# EAGLE schematic motorShield (EAGLE 7.4.0)
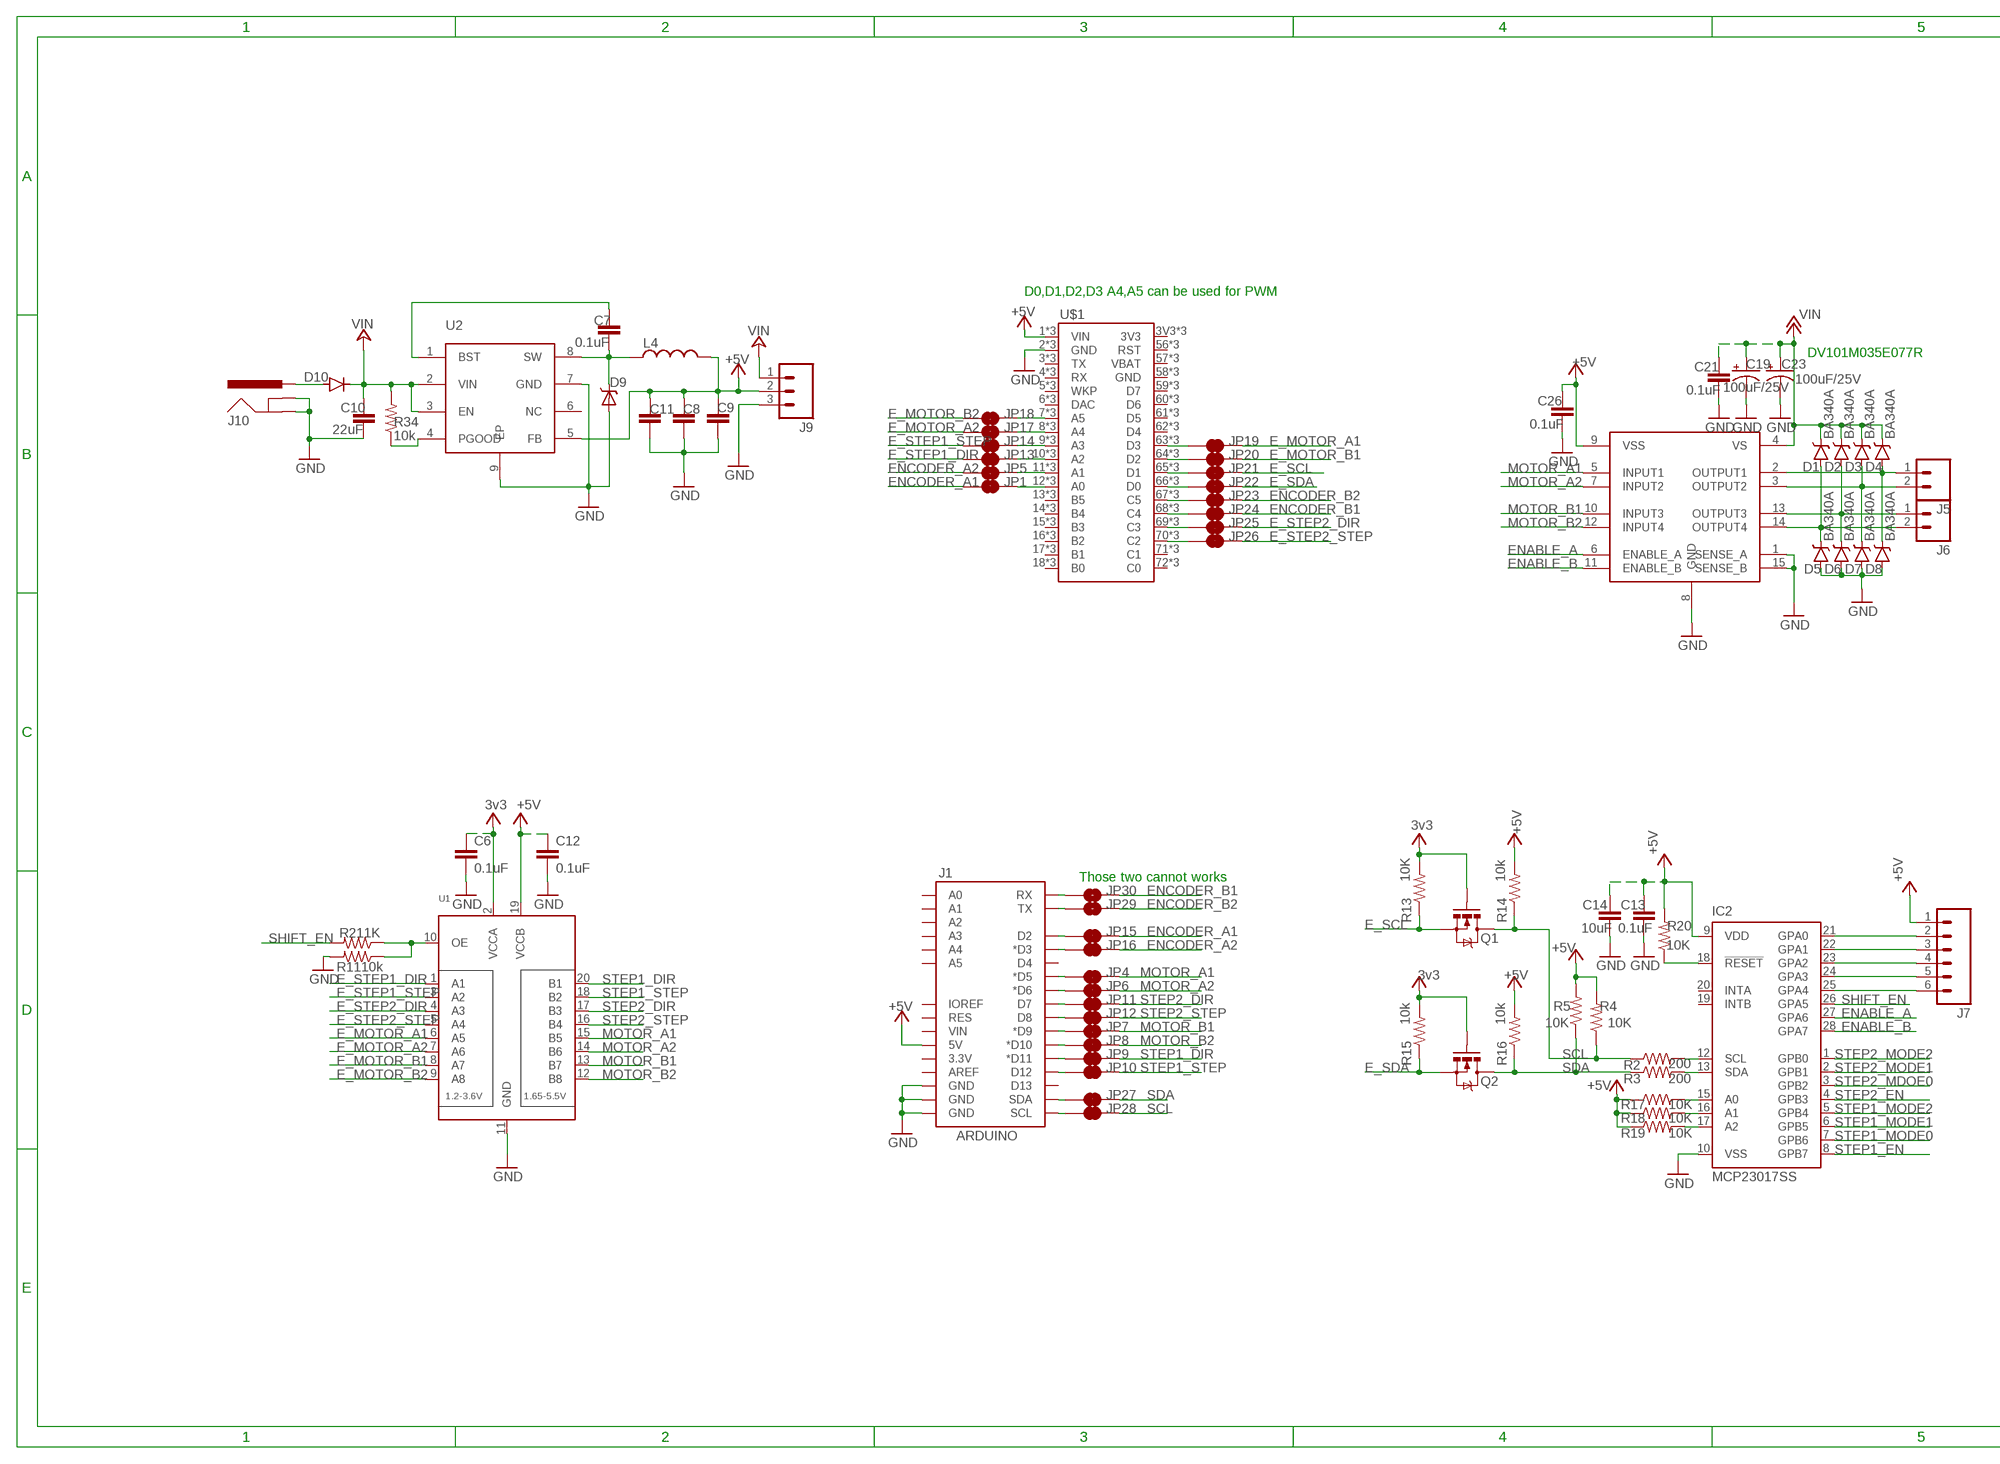
[diagram p0: schematic, sheet 1, part 1 of 2]
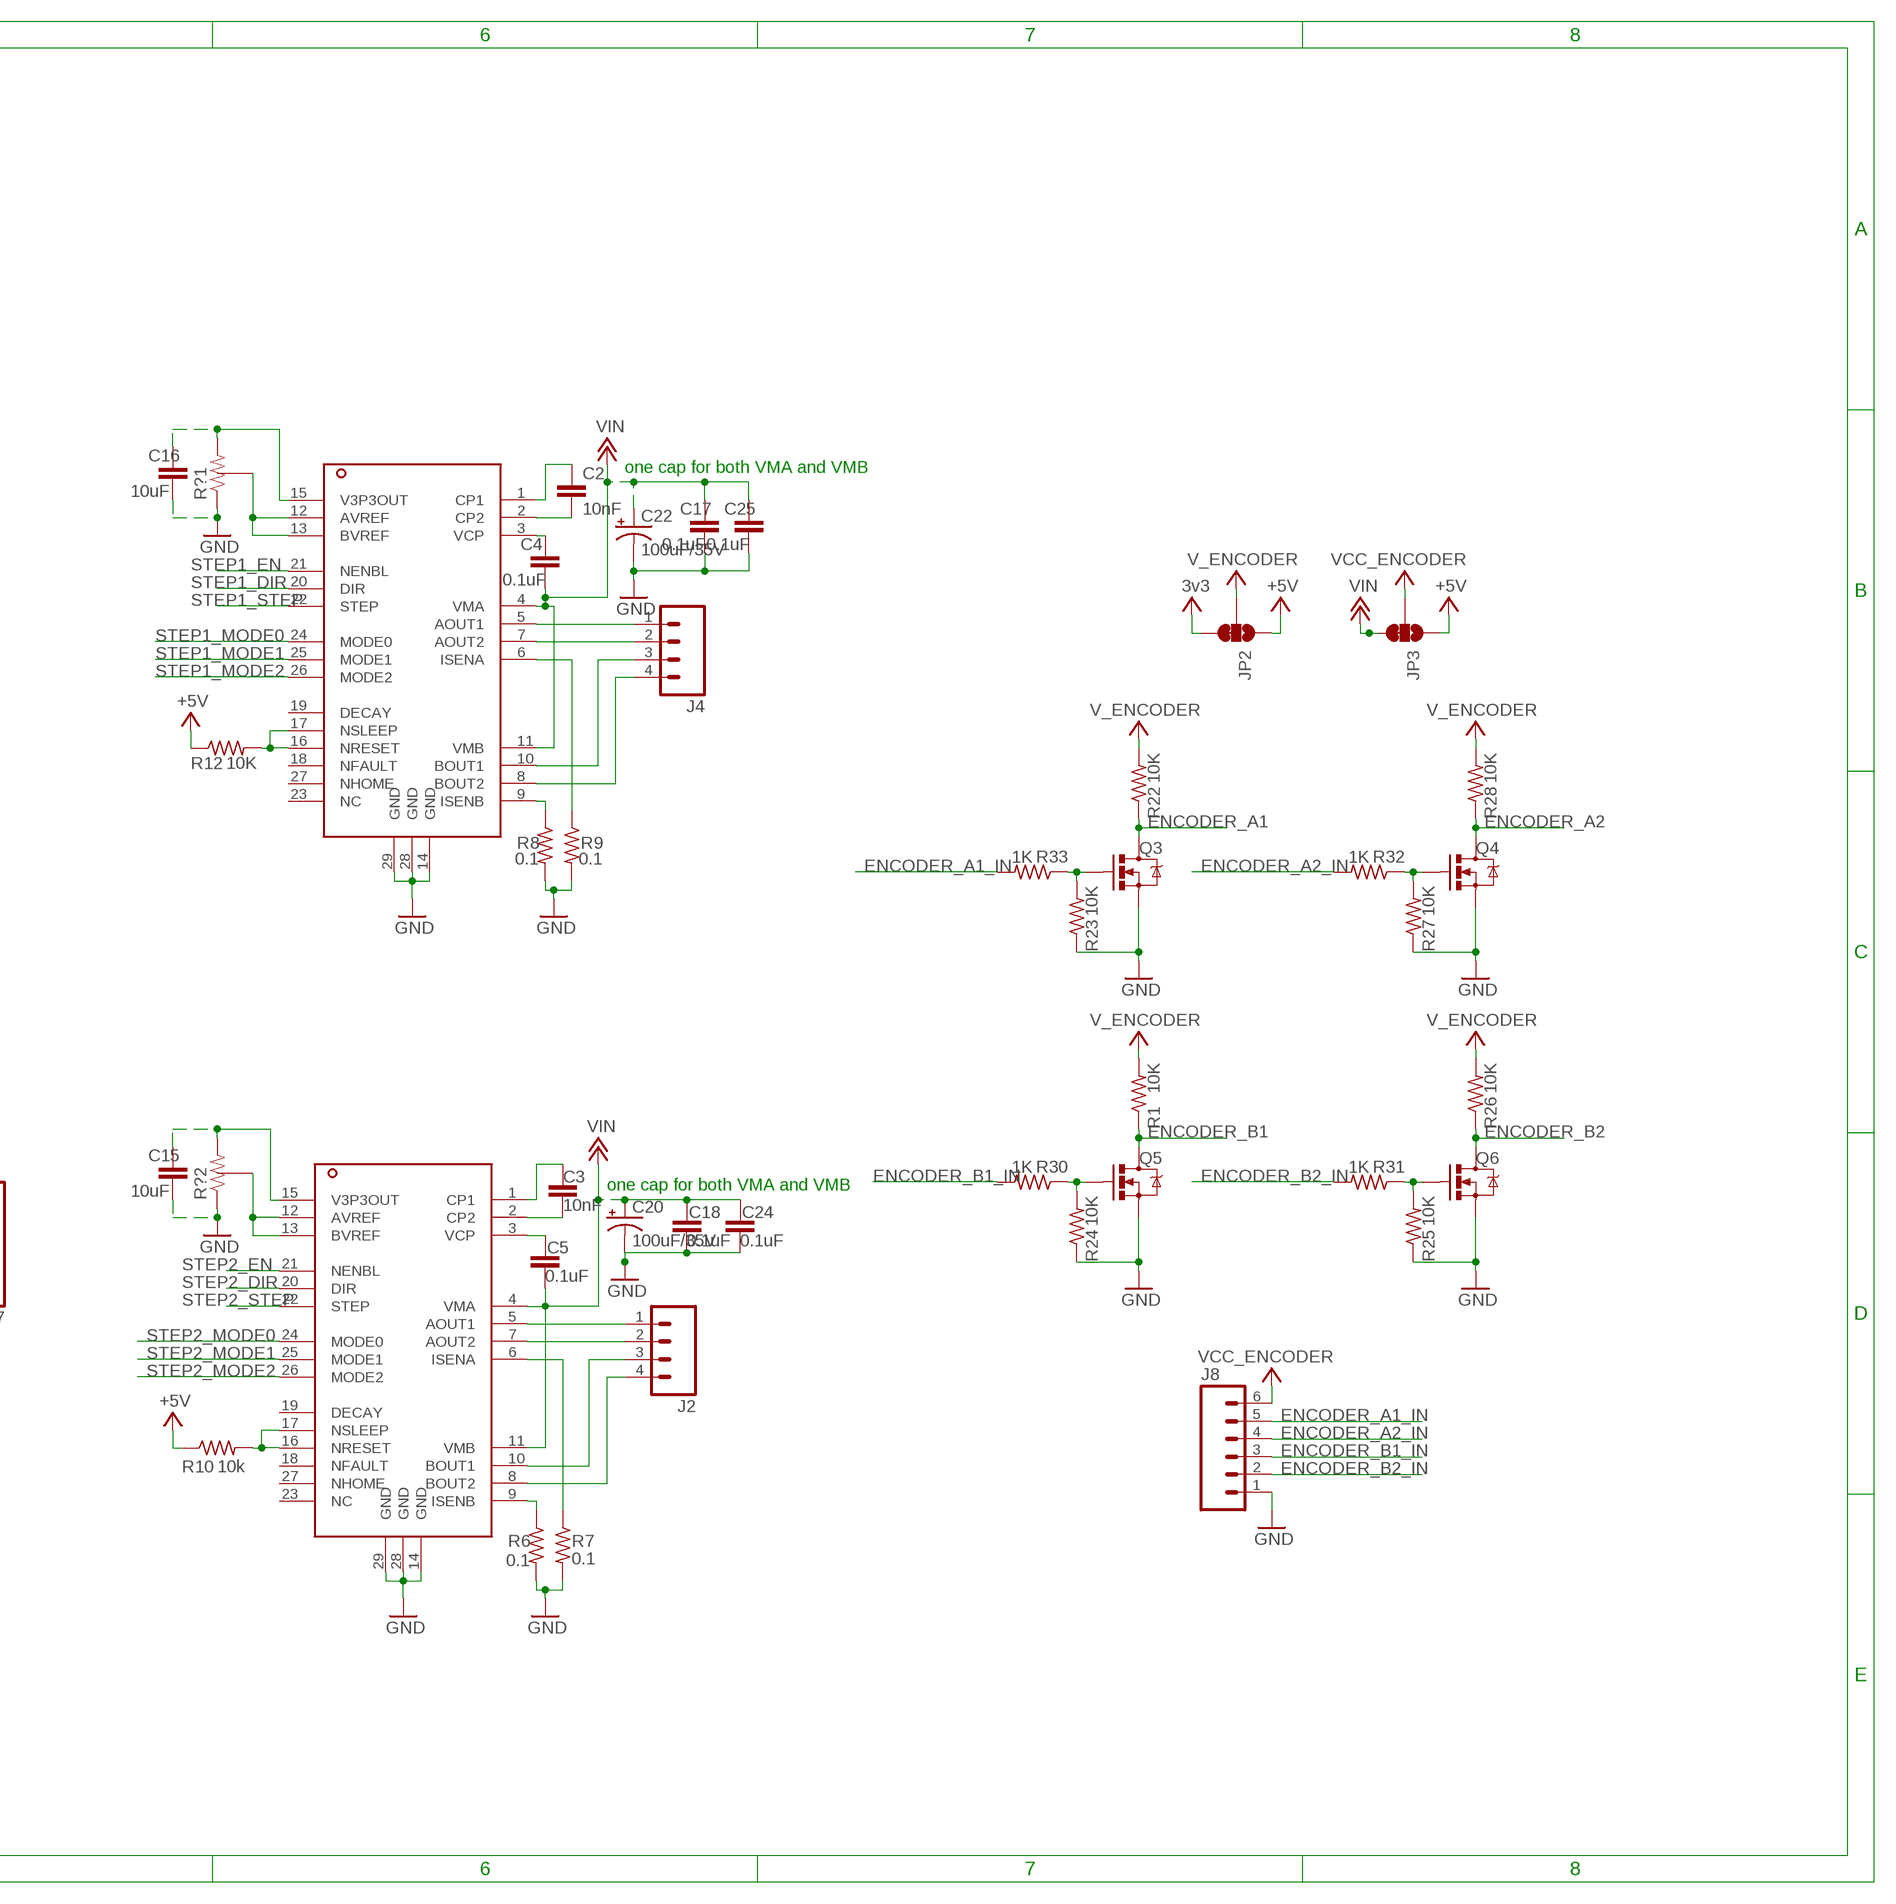
[diagram p1: schematic, sheet 1, part 2 of 2]

## Parts
C2  10nF  CAP_NONE_POL  [0603]
C3  10nF  CAP_NONE_POL  [0603]
C4  0.1uF  CAP_NONE_POL  [0603]
C5  0.1uF  CAP_NONE_POL  [0603]
C6  0.1uF  CAP_NONE_POL  [0603]
C7  0.1uF  0.1UF-100V-10%(0603)  [0603-CAP]
C8  10UF10V10%(0805)  [0805-CAP]
C9  10UF10V10%(0805)  [0805-CAP]
C10  22uF  22UF-16V-20%-(1210)  [1210]
C11  10UF10V10%(0805)  [0805-CAP]
C12  0.1uF  CAP_NONE_POL  [0603]
C13  0.1uF  CAP_NONE_POL  [0603]
C14  10uF  CAP_NONE_POL  [0603]
C15  10uF  CAP_NONE_POL  [0603]
C16  10uF  CAP_NONE_POL  [0603]
C17  0.1uF  CAP_NONE_POL  [0603]
C18  0.1uF  CAP_NONE_POL  [0603]
C19  100uF/25V  CAP_POLD  [PANASONIC_D]
C20  100uF/35V  CAP_POLD  [PANASONIC_D]
C21  0.1uF  CAP_NONE_POL  [0603]
C22  100uF/35V  CAP_POLD  [PANASONIC_D]
C23  100uF/25V  CAP_POLD  [PANASONIC_D]
C24  0.1uF  CAP_NONE_POL  [0603]
C25  0.1uF  CAP_NONE_POL  [0603]
C26  0.1uF  CAP_NONE_POL  [0603]
D1  BA340A  B340A  [SMA-DIODE]
D2  BA340A  B340A  [SMA-DIODE]
D3  BA340A  B340A  [SMA-DIODE]
D4  BA340A  B340A  [SMA-DIODE]
D5  BA340A  B340A  [SMA-DIODE]
D6  BA340A  B340A  [SMA-DIODE]
D7  BA340A  B340A  [SMA-DIODE]
D8  BA340A  B340A  [SMA-DIODE]
D9  DIODE_SCHOTTKYA  [DIODE_SMA]
D10  DIODEB  [DIODE-DO-220AA_NT(SMP)]
IC2  MCP23017SS  [SSOP28]
J1  ARDUINO  ARDUINO_R3_SHIELDUNO_R3_SHIELD_LOCK  [UNO_R3_SHIELD_LOCK]
J2  M04SCREW  [SCREWTERMINAL-3.5MM-4]
J4  M04SCREW  [SCREWTERMINAL-3.5MM-4]
J5  M023.5MM_LOCK  [SCREWTERMINAL-3.5MM-2_LOCK]
J6  M023.5MM_LOCK  [SCREWTERMINAL-3.5MM-2_LOCK]
J7  M06POLAR  [MOLEX-1X6]
J8  M06POLAR  [MOLEX-1X6]
J9  M03SCREW  [SCREWTERMINAL-3.5MM-3]
J10  POWER_JACKPTH  [POWER_JACK_PTH]
JP1  JUMPER-PAD-2-NC_BY_TRACENO_SILK  [PAD-JUMPER-2-NC_BY_TRACE_NO_SILK]
JP2  JUMPER-PAD-3-2OF3_NC_BY_TRACE_LARGE  [PAD-JUMPER-3-2OF3_NC_BY_TRACE_YES_SILK_LARGE]
JP3  JUMPER-PAD-3-2OF3_NC_BY_TRACE_LARGE  [PAD-JUMPER-3-2OF3_NC_BY_TRACE_YES_SILK_LARGE]
JP4  JUMPER-PAD-2-NC_BY_TRACENO_SILK  [PAD-JUMPER-2-NC_BY_TRACE_NO_SILK]
JP5  JUMPER-PAD-2-NC_BY_TRACENO_SILK  [PAD-JUMPER-2-NC_BY_TRACE_NO_SILK]
JP6  JUMPER-PAD-2-NC_BY_TRACENO_SILK  [PAD-JUMPER-2-NC_BY_TRACE_NO_SILK]
JP7  JUMPER-PAD-2-NC_BY_TRACENO_SILK  [PAD-JUMPER-2-NC_BY_TRACE_NO_SILK]
JP8  JUMPER-PAD-2-NC_BY_TRACENO_SILK  [PAD-JUMPER-2-NC_BY_TRACE_NO_SILK]
JP9  JUMPER-PAD-2-NC_BY_TRACENO_SILK  [PAD-JUMPER-2-NC_BY_TRACE_NO_SILK]
JP10  JUMPER-PAD-2-NC_BY_TRACENO_SILK  [PAD-JUMPER-2-NC_BY_TRACE_NO_SILK]
JP11  JUMPER-PAD-2-NC_BY_TRACENO_SILK  [PAD-JUMPER-2-NC_BY_TRACE_NO_SILK]
JP12  JUMPER-PAD-2-NC_BY_TRACENO_SILK  [PAD-JUMPER-2-NC_BY_TRACE_NO_SILK]
JP13  JUMPER-PAD-2-NC_BY_TRACENO_SILK  [PAD-JUMPER-2-NC_BY_TRACE_NO_SILK]
JP14  JUMPER-PAD-2-NC_BY_TRACENO_SILK  [PAD-JUMPER-2-NC_BY_TRACE_NO_SILK]
JP15  JUMPER-PAD-2-NC_BY_TRACENO_SILK  [PAD-JUMPER-2-NC_BY_TRACE_NO_SILK]
JP16  JUMPER-PAD-2-NC_BY_TRACENO_SILK  [PAD-JUMPER-2-NC_BY_TRACE_NO_SILK]
JP17  JUMPER-PAD-2-NC_BY_TRACENO_SILK  [PAD-JUMPER-2-NC_BY_TRACE_NO_SILK]
JP18  JUMPER-PAD-2-NC_BY_TRACENO_SILK  [PAD-JUMPER-2-NC_BY_TRACE_NO_SILK]
JP19  JUMPER-PAD-2-NC_BY_TRACENO_SILK  [PAD-JUMPER-2-NC_BY_TRACE_NO_SILK]
JP20  JUMPER-PAD-2-NC_BY_TRACENO_SILK  [PAD-JUMPER-2-NC_BY_TRACE_NO_SILK]
JP21  JUMPER-PAD-2-NC_BY_TRACENO_SILK  [PAD-JUMPER-2-NC_BY_TRACE_NO_SILK]
JP22  JUMPER-PAD-2-NC_BY_TRACENO_SILK  [PAD-JUMPER-2-NC_BY_TRACE_NO_SILK]
JP23  JUMPER-PAD-2-NC_BY_TRACENO_SILK  [PAD-JUMPER-2-NC_BY_TRACE_NO_SILK]
JP24  JUMPER-PAD-2-NC_BY_TRACENO_SILK  [PAD-JUMPER-2-NC_BY_TRACE_NO_SILK]
JP25  JUMPER-PAD-2-NC_BY_TRACENO_SILK  [PAD-JUMPER-2-NC_BY_TRACE_NO_SILK]
JP26  JUMPER-PAD-2-NC_BY_TRACENO_SILK  [PAD-JUMPER-2-NC_BY_TRACE_NO_SILK]
JP27  JUMPER-PAD-2-NC_BY_TRACENO_SILK  [PAD-JUMPER-2-NC_BY_TRACE_NO_SILK]
JP28  JUMPER-PAD-2-NC_BY_TRACENO_SILK  [PAD-JUMPER-2-NC_BY_TRACE_NO_SILK]
JP29  JUMPER-PAD-2-NO  [PAD-JUMPER-2-NO_NO_SILK]
JP30  JUMPER-PAD-2-NO  [PAD-JUMPER-2-NO_NO_SILK]
L4  INDUCTOR4818  [I4818]
Q1  MOSFET-NCHANNELBSS138  [SOT23]
Q2  MOSFET-NCHANNELBSS138  [SOT23]
Q3  MOSFET-NCHANNELBSS138  [SOT23]
Q4  MOSFET-NCHANNELBSS138  [SOT23]
Q5  MOSFET-NCHANNELBSS138  [SOT23]
Q6  MOSFET-NCHANNELBSS138  [SOT23]
R1  10K  R-US_A  [R0603]
R2  200  R-US_A  [R0603]
R3  200  R-US_A  [R0603]
R4  10K  R-US_A  [R0603]
R5  10K  R-US_A  [R0603]
R6  0.1  R-US_M1206  [M1206]
R7  0.1  R-US_M1206  [M1206]
R8  0.1  R-US_M1206  [M1206]
R9  0.1  R-US_M1206  [M1206]
R10  10k  R-US_A  [R0603]
R11  10k  20OHM1/10W1%(0603)SMD  [0603-RES]
R12  10K  R-US_A  [R0603]
R13  10K  R-US_A  [R0603]
R14  10k  R-US_A  [R0603]
R15  10k  R-US_A  [R0603]
R16  10k  R-US_A  [R0603]
R17  10K  R-US_A  [R0603]
R18  10K  R-US_A  [R0603]
R19  10K  R-US_A  [R0603]
R20  10K  R-US_A  [R0603]
R21  1K  20OHM1/10W1%(0603)SMD  [0603-RES]
R22  10K  R-US_A  [R0603]
R23  10K  R-US_A  [R0603]
R24  10K  R-US_A  [R0603]
R25  10K  R-US_A  [R0603]
R26  10K  R-US_A  [R0603]
R27  10K  R-US_A  [R0603]
R28  10K  R-US_A  [R0603]
R30  1K  R-US_A  [R0603]
R31  1K  R-US_A  [R0603]
R32  1K  R-US_A  [R0603]
R33  1K  R-US_A  [R0603]
R34  10k  20OHM1/10W1%(0603)SMD  [0603-RES]
R?1  POTENTIAL_RESISTOR  [POTENTIAL_RESISTOR]
R?2  POTENTIAL_RESISTOR  [POTENTIAL_RESISTOR]
U1  TXB0108PWR  [TSSOP20]
U2  ADP2303  [ADP2302]
U$1  ELECTRONDUALROW  [ELECTRON_DUAL-ROW]
U?1  DRV8825  [DRV8825]
U?2  L298  [L298]
U?3  DRV8825  [DRV8825]

## Nets
+3V3: C6.1(ANODE) JP2.3 Q1.1(G) Q2.1(G) R13.2 R15.2 U1.2(VCCA) ; supply symbol labelled 3v3
+5V: C8.2 C9.2 C11.1 C12.1(ANODE) C13.1(ANODE) C14.1(ANODE) C26.1(ANODE) IC2.9(VDD) J1.5V J7.1 J8.6 J9.2 JP2.1 JP2.2 JP3.1 JP3.2 L4.2 R1.2 R4.2 R5.2 R10.1 R12.1 R14.2 R16.2 R17.1 R18.1 R19.1 R20.2 R22.2 R26.2 R28.2 U1.19(VCCB) U2.5(FB) U$1.1(VIN) U$1.37(VIN) U$1.VIN U?2.9(VSS) ; supply symbol labelled V_ENCODER, VCC_ENCODER
+12V: C4.2(CATHODE) C5.2(CATHODE) C17.1(ANODE) C18.1(ANODE) C19.+ C20.+ C21.1(ANODE) C22.+ C23.+ C24.1(ANODE) C25.1(ANODE) D1.C D2.C D3.C D4.C JP3.3 U?1.4(VMA) U?1.11(VMB) U?2.4(VS) U?3.4(VMA) U?3.11(VMB) ; supply symbol labelled VIN
+24V: C10.1 D10.CATHODE J9.1 R34.2 U2.2(VIN) U2.3(EN) ; supply symbol labelled VIN
E_MOTOR_A1: JP19.2 U1.6(A5)
E_MOTOR_A2: JP17.1 U1.7(A6)
E_MOTOR_B1: JP20.2 U1.8(A7)
E_MOTOR_B2: JP18.1 U1.9(A8)
E_SCL: JP21.2 Q1.2(S) R13.1
E_SDA: JP22.2 Q2.2(S) R15.1
E_STEP1_DIR: JP13.1 U1.1(A1)
E_STEP1_STEP: JP14.1 U1.3(A2)
E_STEP2_DIR: JP25.2 U1.4(A3)
E_STEP2_STEP: JP26.2 U1.5(A4)
ENABLE_A: IC2.27(GPA6) U?2.6(ENABLE_A)
ENABLE_B: IC2.28(GPA7) U?2.11(ENABLE_B)
ENCODER_A1: JP1.1 JP15.2 Q3.3(D) R22.1
ENCODER_A1_IN: J8.5 R33.2
ENCODER_A2: JP5.1 JP16.2 Q4.3(D) R28.1
ENCODER_A2_IN: J8.4 R32.2
ENCODER_B1: JP24.2 JP30.2 Q5.3(D) R1.1
ENCODER_B1_IN: J8.3 R30.2
ENCODER_B2: JP23.2 JP29.2 Q6.3(D) R26.1
ENCODER_B2_IN: J8.2 R31.2
GND: C6.2(CATHODE) C8.1 C9.1 C10.2 C11.2 C12.2(CATHODE) C13.2(CATHODE) C14.2(CATHODE) C15.2(CATHODE) C16.2(CATHODE) C17.2(CATHODE) C18.2(CATHODE) C19.- C20.- C21.2(CATHODE) C22.- C23.- C24.2(CATHODE) C25.2(CATHODE) C26.2(CATHODE) D5.A D6.A D7.A D8.A D9.ANODE IC2.10(VSS) J1.GND@0(GND) J1.GND@1(GND) J1.GND@2(GND) J8.1 J9.3 J10.GND J10.GNDBREAK Q3.2(S) Q4.2(S) Q5.2(S) Q6.2(S) R6.2 R7.2 R8.2 R9.2 R11.2 R23.1 R24.1 R25.1 R27.1 R?1.1 R?2.1 U1.11(GND) U2.7(GND) U2.9(EP) U$1.2(GND) U$1.38(GND) U$1.GND@2(GND) U?1.14(GND) U?1.28(GND) U?1.29(GND) U?2.1(SENSE_A) U?2.8(GND) U?2.15(SENSE_B) U?3.14(GND) U?3.28(GND) U?3.29(GND)
MOTOR_A1: JP4.2 U1.15(B5) U?2.5(INPUT1)
MOTOR_A2: JP6.2 U1.14(B6) U?2.7(INPUT2)
MOTOR_B1: JP7.2 U1.13(B7) U?2.10(INPUT3)
MOTOR_B2: JP8.2 U1.12(B8) U?2.12(INPUT4)
N$1: IC2.13(SDA) R3.2
N$2: IC2.12(SCL) R2.2
N$3: C3.2(CATHODE) U?3.2(CP2)
N$4: C3.1(ANODE) U?3.1(CP1)
N$5: C2.2(CATHODE) U?1.2(CP2)
N$6: C2.1(ANODE) U?1.1(CP1)
N$7: R6.1 U?3.9(ISENB)
N$8: R7.1 U?3.6(ISENA)
N$9: R10.2 U?3.16(NRESET) U?3.17(NSLEEP)
N$10: D4.A D8.C J5.1 U?2.2(OUTPUT1)
N$11: J2.1 U?3.5(AOUT1)
N$12: J2.2 U?3.7(AOUT2)
N$13: J2.3 U?3.10(BOUT1)
N$14: J2.4 U?3.8(BOUT2)
N$15: R8.1 U?1.9(ISENB)
N$16: R9.1 U?1.6(ISENA)
N$17: J4.1 U?1.5(AOUT1)
N$18: J4.2 U?1.7(AOUT2)
N$19: J4.3 U?1.10(BOUT1)
N$20: J4.4 U?1.8(BOUT2)
N$21: C4.1(ANODE) U?1.3(VCP)
N$22: C5.1(ANODE) U?3.3(VCP)
N$23: D3.A D7.C J5.2 U?2.3(OUTPUT2)
N$24: D2.A D6.C J6.1 U?2.13(OUTPUT3)
N$25: D1.A D5.C J6.2 U?2.14(OUTPUT4)
N$26: R11.1 R21.1 U1.10(OE)
N$27: IC2.15(A0) R17.2
N$28: R12.2 U?1.16(NRESET) U?1.17(NSLEEP)
N$29: IC2.16(A1) R18.2
N$30: IC2.17(A2) R19.2
N$31: R?1.3 U?1.12(AVREF) U?1.13(BVREF)
N$32: IC2.18(!RESET) R20.1
N$33: J1.SCL JP28.1
N$34: R?2.3 U?3.12(AVREF) U?3.13(BVREF)
N$35: J1.SDA JP27.1
N$36: J1.D5(*D5) JP4.1
N$37: J1.D6(*D6) JP6.1
N$38: J1.D9(*D9) JP7.1
N$39: J1.D10(*D10) JP8.1
N$40: J1.D11(*D11) JP9.1
N$41: J1.D12 JP10.1
N$42: J1.D8 JP12.1
N$43: J1.D7 JP11.1
N$44: IC2.25(GPA4) J7.6
N$45: IC2.24(GPA3) J7.5
N$46: J1.D2 JP15.1
N$47: J1.D3(*D3) JP16.1
N$48: IC2.23(GPA2) J7.4
N$49: IC2.22(GPA1) J7.3
N$50: IC2.21(GPA0) J7.2
N$51: Q4.1(G) R27.2 R32.1
N$52: Q5.1(G) R24.2 R30.1
N$53: Q6.1(G) R25.2 R31.1
N$54: C7.2 D9.CATHODE L4.1 U2.8(SW)
N$55: Q3.1(G) R23.2 R33.1
N$56: C7.1 U2.1(BST)
N$57: R34.1 U2.4(PGOOD)
N$58: D10.ANODE J10.PWR
N$59: JP1.2 U$1.12(A0) U$1.48(A0) U$1.A0
N$60: JP5.2 U$1.11(A1) U$1.47(A1) U$1.A1
N$61: JP13.2 U$1.10(A2) U$1.46(A2) U$1.A2
N$62: JP14.2 U$1.9(A3) U$1.45(A3) U$1.A3
N$63: JP17.2 U$1.8(A4) U$1.44(A4) U$1.A4
N$64: JP18.2 U$1.7(A5) U$1.43(A5) U$1.A5
N$65: JP19.1 U$1.63(D3) U$1.99(D3) U$1.D3
N$66: JP20.1 U$1.64(D2) U$1.100(D2) U$1.D2
N$67: JP21.1 U$1.65(D1) U$1.101(D1) U$1.D1
N$68: JP22.1 U$1.66(D0) U$1.102(D0) U$1.D0
N$69: JP23.1 U$1.67(C5) U$1.103(C5) U$1.C5
N$70: JP24.1 U$1.68(C4) U$1.104(C4) U$1.C4
N$71: JP25.1 U$1.69(C3) U$1.105(C3) U$1.C3
N$72: JP26.1 U$1.70(C2) U$1.106(C2) U$1.C2
N$73: C15.1(ANODE) R?2.2 U?3.15(V3P3OUT)
N$74: J1.TX JP29.1
N$75: J1.RX JP30.1
N$78: C16.1(ANODE) R?1.2 U?1.15(V3P3OUT)
SCL: JP28.2 Q1.3(D) R2.1 R4.1 R14.1
SDA: JP27.2 Q2.3(D) R3.1 R5.1 R16.1
SHIFT_EN: IC2.26(GPA5) R21.2
STEP1_DIR: JP9.2 U1.20(B1) U?1.20(DIR)
STEP1_EN: IC2.8(GPB7) U?1.21(NENBL)
STEP1_MODE0: IC2.7(GPB6) U?1.24(MODE0)
STEP1_MODE1: IC2.6(GPB5) U?1.25(MODE1)
STEP1_MODE2: IC2.5(GPB4) U?1.26(MODE2)
STEP1_STEP: JP10.2 U1.18(B2) U?1.22(STEP)
STEP2_DIR: JP11.2 U1.17(B3) U?3.20(DIR)
STEP2_EN: IC2.4(GPB3) U?3.21(NENBL)
STEP2_MDOE0: IC2.3(GPB2)
STEP2_MODE0: U?3.24(MODE0)
STEP2_MODE1: IC2.2(GPB1) U?3.25(MODE1)
STEP2_MODE2: IC2.1(GPB0) U?3.26(MODE2)
STEP2_STEP: JP12.2 U1.16(B4) U?3.22(STEP)
Unconnected: IC2.19(INTB) IC2.20(INTA) J1.3.3V J1.A0 J1.A1 J1.A2 J1.A3 J1.A4 J1.A5 J1.AREF J1.D4 J1.D13 J1.IOREF J1.RES J1.VIN U2.6(NC) U$1.3(TX) U$1.4(RX) U$1.5(WKP) U$1.6(DAC) U$1.13(B5) U$1.14(B4) U$1.15(B3) U$1.16(B2) U$1.17(B1) U$1.18(B0) U$1.39(TX) U$1.40(RX) U$1.41(WKP) U$1.42(DAC) U$1.49(B5) U$1.50(B4) U$1.51(B3) U$1.52(B2) U$1.53(B1) U$1.54(B0) U$1.56(RST) U$1.57(VBAT) U$1.59(D7) U$1.60(D6) U$1.61(D5) U$1.62(D4) U$1.71(C1) U$1.72(C0) U$1.92(RST) U$1.93(VBAT) U$1.95(D7) U$1.96(D6) U$1.97(D5) U$1.98(D4) U$1.107(C1) U$1.108(C0) U$1.B0 U$1.B1 U$1.B2 U$1.B3 U$1.B4 U$1.B5 U$1.C0 U$1.C1 U$1.D4 U$1.D5 U$1.D6 U$1.D7 U$1.DAC U$1.RST U$1.RX U$1.TX U$1.VBAT U$1.WKP U?1.18(NFAULT) U?1.19(DECAY) U?1.23(NC) U?1.27(NHOME) U?3.18(NFAULT) U?3.19(DECAY) U?3.23(NC) U?3.27(NHOME)

## Notes on the sheet
- D0,D1,D2,D3 A4,A5 can be used for PWM
- DV101M035E077R
- one cap for both VMA and VMB
- Those two cannot works
- one cap for both VMA and VMB

## Power pins joined to a net without a drawn wire
3V3: U$1.3V3 U$1.55(3V3) U$1.91(3V3)
GND: U$1.58(GND) U$1.94(GND) U$1.GND

## Library data of the parts
C2-C6 C12-C18 C21 C24-C26 = Particle:CAP_NONE_POL
C7 = SparkFun-Capacitors:0.1UF-100V-10%(0603): CAP-08390; PROD_ID: CAP-08390
C8 C9 C11 = programming-rig-v402:10UF10V10%(0805): CAP-11330; PROD_ID: CAP-11330
C10 = programming-rig-v402:22UF-16V-20%-(1210): CAP-10381; PROD_ID: CAP-10381
C19 C20 C22 C23 = SparkFun-Capacitors:CAP_POL: Capacitor Polarized These are standard SMD and PTH capacitors. Normally 10uF, 47uF, and 100uF in electrolytic and tantalum varieties. Always verify the external diameter of the through hole cap, it varies with capacity, voltage, and manufacturer. The EIA devices should be standard.
D1-D8 = SparkFun-DiscreteSemi:B340A: Schottky Diode 3A-40V; PROD_ID: DIO-09886
D9 = Particle:DIODE_SCHOTTKY
D10 = Particle:DIODE
IC2 = programming-rig-v402:MCP23017: http://ww1.microchip.com/downloads/en/DeviceDoc/21952a.pdf Source: http://ww1.microchip.com/downloads/en/DeviceDoc/21952a.pdf
J1 = SparkFun-Boards:ARDUINO_R3_SHIELD: Shield form compatible with the Arduino Uno R3.
J2 J4 = SparkFun-Connectors:M04: Header 4 Standard 4-pin 0.1" header. Use with straight break away headers (SKU : PRT-00116), right angle break away headers (PRT-00553), swiss pins (PRT-00743), machine pins (PRT-00117), and female headers (PRT-00115). Molex polarized connector foot print use with SKU : PRT-08231 with associated crimp pins and housings. 1MM SMD Version SKU: PRT-10208; PROD_ID: Combine 2x8399
J5 J6 = SparkFun-Connectors:M02: Standard 2-pin 0.1" header. Use with - straight break away headers ( PRT-00116) - right angle break away headers (PRT-00553) - swiss pins (PRT-00743) - machine pins (PRT-00117) - female headers (PRT-00115) Molex polarized connector foot print use with: PRT-08233 with associated crimp pins and housings. 2.54_SCREWTERM for use with PRT-10571. 3.5mm Screw Terminal footprints for PRT-08084 5mm Screw Terminal footprints for use with PRT-08432; PROD_ID: CONN-08399
J7 J8 = SparkFun-Connectors:M06: Header 6 Standard 6-pin 0.1" header. Use with straight break away headers (SKU : PRT-00116), right angle break away headers (PRT-00553), swiss pins (PRT-00743), machine pins (PRT-00117), and female headers (PRT-00115). Molex polarized connector foot print use with SKU : PRT-08094 with associated crimp pins and housings. NOTES ON THE VARIANTS LOCK and LOCK_LONGPADS... This footprint was designed to help hold the alignment of a through-hole component (i.e. 6-pin header) while soldering it into place. You may notice that each hole has been shifted either up or down by 0.005 of an inch from it's more standard position (which is a perfectly straight line). This slight alteration caused the pins (the squares in the middle) to touch the edges of the holes. Because they are alternating, it causes a "brace" to hold the component in place. 0.005 has proven to be the perfect amount of "off-center" position when using our standard breakaway headers. Although looks a little odd when you look at the bare footprint, once you have a header in there, the alteration is very hard to notice. Also,if you push a header all the way into place, it is covered up entirely on the bottom side. This idea of altering the position of holes to aid alignment will be further integrated into the Sparkfun Library for other footprints. It can help hold any component with 3 or more connection pins.
J9 = SparkFun-Connectors:M03: Header 3 Standard 3-pin 0.1" header. Use with straight break away headers (SKU : PRT-00116), right angle break away headers (PRT-00553), swiss pins (PRT-00743), machine pins (PRT-00117), and female headers (PRT-00115). Molex polarized connector foot print use with SKU : PRT-08232 with associated crimp pins and housings.; PROD_ID: CONN-08288
J10 = SparkFun-Connectors:POWER_JACK: Power Jack This is the standard 5.5mm barrel jack for power. The PTH is the most common, proven, reliable, footprint. The Slot footprint only works if the mill layer is transmitted to the PCB fab house so be warned. Mating wall wart : TOL-00298 (and others); PROD_ID: CONN-08197
JP1 JP4-JP28 = SparkFun-Passives:JUMPER-PAD-2-NC_BY_TRACE
JP2 JP3 = SparkFun-Passives:JUMPER-PAD-3-2OF3_NC_BY_TRACE
JP29 JP30 = SparkFun-Passives:JUMPER-PAD-2-NO
L4 = programming-rig-v402:INDUCTOR: Inductors Basic Inductor/Choke - 0603 and 1206. Footprints are not proven and vary greatly between part numbers.
Q1-Q6 = shield-shield:MOSFET-NCHANNEL: Common NMOSFET Parts MFG P/N Store ID Prod ID FDD8780 TRANS-09984 SI7820DN TRANS-11055 FDS6630A IC-08089 2N7002PW TRANS-11151 FQP30N06L COM-10213 TRANS-10060 BSS123LT1G TRANS-08345 BSS138 TRANS-00830 BS170 2N7000; PROD_ID: TRANS-00830
R1-R5 R10 R12-R20 R22-R28 R30-R33 = Particle:R-US_: 0402 Resistor
R6-R9 = programming-rig-v402:R-US_: RESISTOR, American symbol
R11 R21 R34 = SparkFun-Resistors:20OHM1/10W1%(0603): RES-07862; PROD_ID: RES-07862; VALUE: 20
R?1 R?2 = SparkFun-Resistors:POTENTIAL_RESISTOR
U1 = shield-shield:TXB0108PWR: 8-Bit Bi-Directional Level Shifter 1.2V-3.6V (VCCA) to 1.65V-5.5V (VCCB) bi-directional level shifter with auto direction sensing. Max data rate - VCCA 1.8V: 20Mbps (50ns), VCCA 3.3V: 100Mbps (10ns) Digikey: 296-21527-1-ND
U2 = Particle:ADP2303
U$1 = Particle:ELECTRON
U?1 U?3 = Particle:DRV8825
U?2 = Particle:L298